# EAGLE design cc2650_rev1-1 (EAGLE 8.3.2)

## Sheet 1 of 2
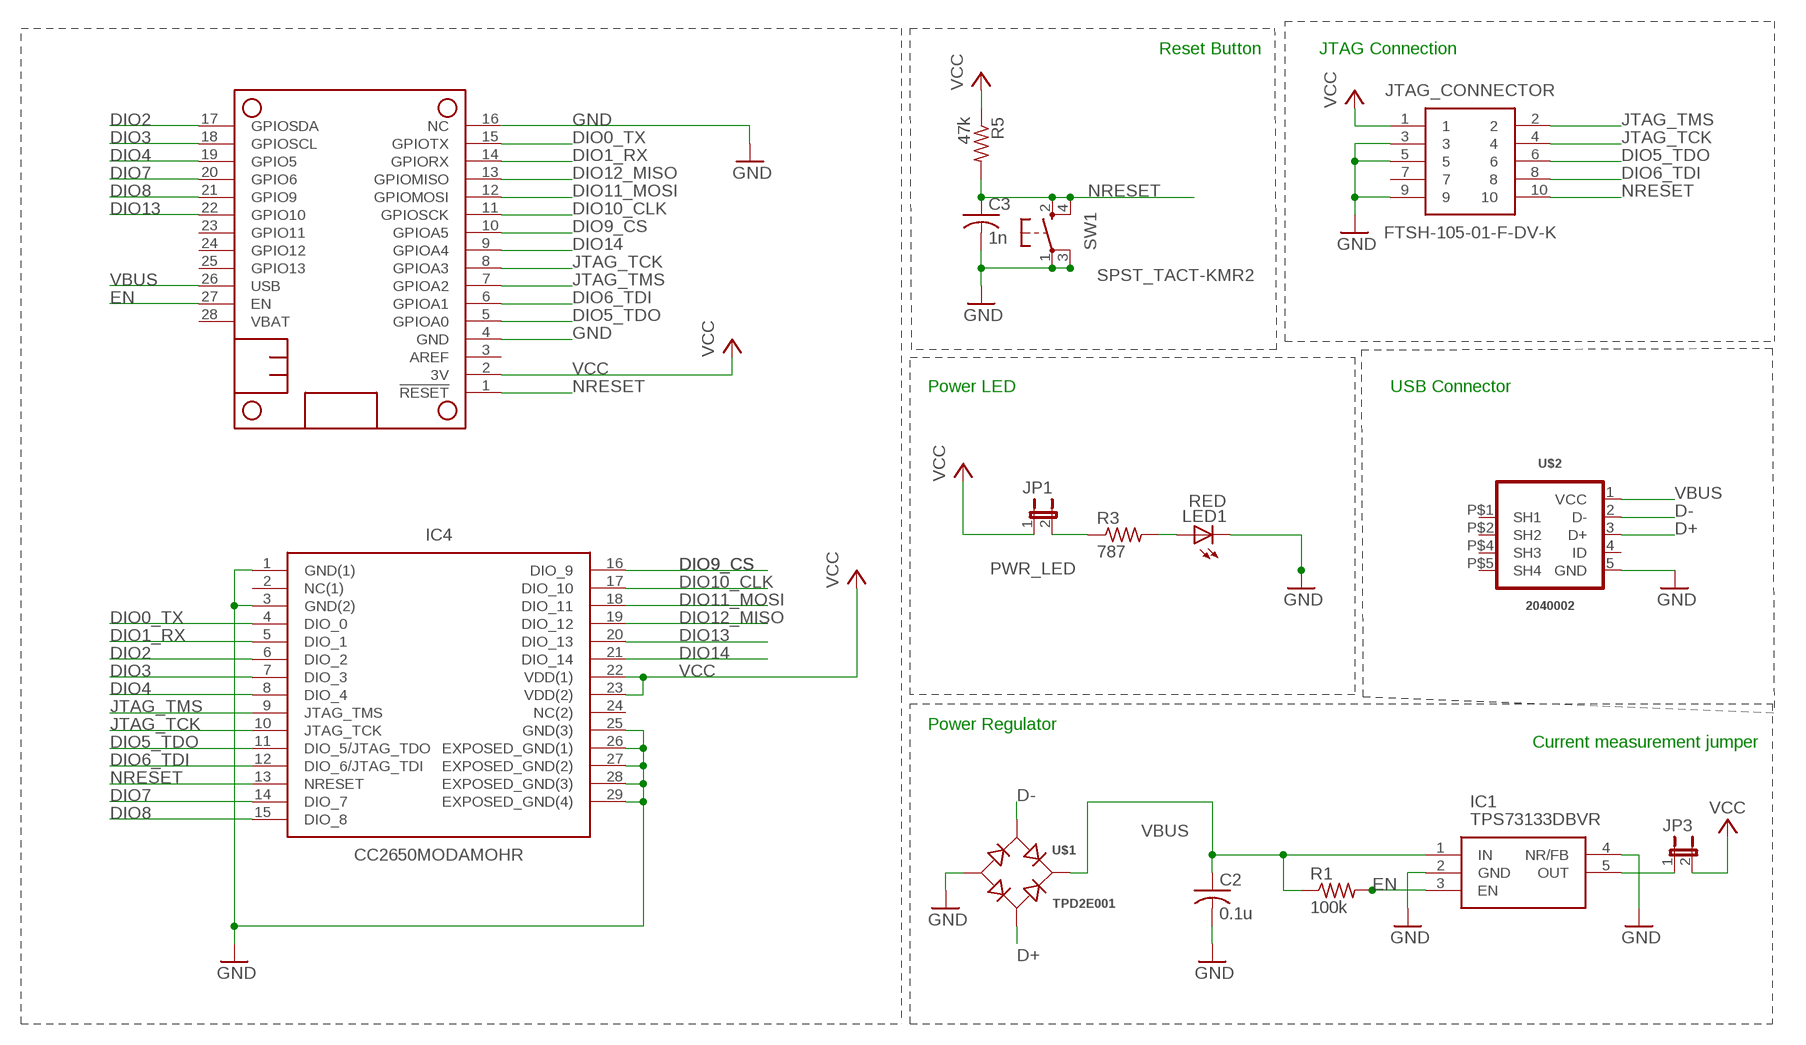
[diagram p0: schematic, sheet 1]

### Parts
C2  0.1u  C-USC1206  [C1206]
C3  1n  C-USC1206  [C1206]
IC1  TPS73133DBVR  [SOT95P280X145-5N]
IC4  CC2650MODAMOHR  [MOH0029A]
JP1  PWR_LED  JP1M  [JP1M]
JP3  PWR_LED  JP1M  [JP1M]
JTAG_CONNECTOR  FTSH-105-01-F-DV-K  [SAMTEC_FTSH-105-01-L-DV]
LED1  RED  LEDCHIPLED_1206  [CHIPLED_1206]
MS1  FEATHERWING_NODIM  [FEATHERWING_DIM]
R1  100k  R-US_R1206  [R1206]
R3  787  R-US_R1206  [R1206]
R5  47k  R-US_R1206  [R1206]
SW1  SPST_TACT-KMR2  [KMR2]
U$1  TPD2E001  [SOT-143]
U$2  2040002  [2040002]

### Nets
D+: U$1.3(AC2) U$2.3(D+)
D-: U$1.2(AC1) U$2.2(D-)
DIO0_TX: IC4.4(DIO_0) MS1.15(GPIOTX)
DIO1_RX: IC4.5(DIO_1) MS1.14(GPIORX)
DIO2: IC4.6(DIO_2) MS1.17(GPIOSDA)
DIO3: IC4.7(DIO_3) MS1.18(GPIOSCL)
DIO4: IC4.8(DIO_4) MS1.19(GPIO5)
DIO5_TDO: IC4.11(DIO_5/JTAG_TDO) JTAG_CONNECTOR.6 MS1.5(GPIOA0)
DIO6_TDI: IC4.12(DIO_6/JTAG_TDI) JTAG_CONNECTOR.8 MS1.6(GPIOA1)
DIO7: IC4.14(DIO_7) MS1.20(GPIO6)
DIO8: IC4.15(DIO_8) MS1.21(GPIO9)
DIO9_CS: IC4.16(DIO_9) MS1.10(GPIOA5)
DIO10_CLK: IC4.17(DIO_10) MS1.11(GPIOSCK)
DIO11_MOSI: IC4.18(DIO_11) MS1.12(GPIOMOSI)
DIO12_MISO: IC4.19(DIO_12) MS1.13(GPIOMISO)
DIO13: IC4.20(DIO_13) MS1.22(GPIO10) ; also sheet 2
DIO14: IC4.21(DIO_14) MS1.9(GPIOA4) ; also sheet 2
EN: IC1.3(EN) MS1.27(EN) R1.2
GND: C2.2 C3.2 IC1.2(GND) IC1.4(NR/FB) IC4.1(GND(1)) IC4.3(GND(2)) IC4.25(GND(3)) IC4.26(EXPOSED_GND(1)) IC4.27(EXPOSED_GND(2)) IC4.28(EXPOSED_GND(3)) IC4.29(EXPOSED_GND(4)) JTAG_CONNECTOR.3 JTAG_CONNECTOR.5 JTAG_CONNECTOR.9 LED1.C MS1.4(GND) MS1.16(NC) SW1.1(P) SW1.3(P1) U$1.1(-) U$2.5(GND) ; also sheet 2
JTAG_TCK: IC4.10(JTAG_TCK) JTAG_CONNECTOR.4 MS1.8(GPIOA3)
JTAG_TMS: IC4.9(JTAG_TMS) JTAG_CONNECTOR.2 MS1.7(GPIOA2)
NRESET: C3.1 IC4.13(NRESET) JTAG_CONNECTOR.10 MS1.1(!RESET) R5.2 SW1.2(S) SW1.4(S1)
PWR_LED: LED1.A R3.2
PWR_LED_JPR: JP1.2 R3.1
VBUS [Power]: C2.1 IC1.1(IN) MS1.26(USB) R1.1 U$1.4(+) U$2.1(VCC)
VCC: IC4.22(VDD(1)) IC4.23(VDD(2)) JP1.1 JP3.2 JTAG_CONNECTOR.1 MS1.2(3V) R5.1
VCC_JPR: IC1.5(OUT) JP3.1
Unconnected: IC4.2(NC(1)) IC4.24(NC(2)) JTAG_CONNECTOR.7 MS1.3(AREF) MS1.23(GPIO11) MS1.24(GPIO12) MS1.25(GPIO13) MS1.28(VBAT) U$2.4(ID) U$2.P$1(SH1) U$2.P$2(SH2) U$2.P$4(SH3) U$2.P$5(SH4)

### Notes on the sheet
- Reset Button | JTAG Connection
- Power LED | USB Connector
- Power Regulator
- Current measurement jumper

## Sheet 2 of 2
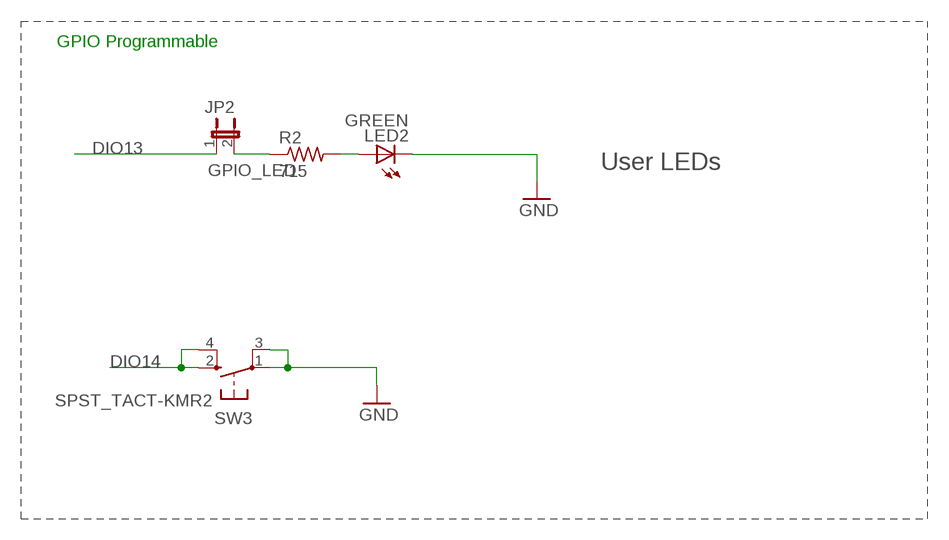
[diagram p1: schematic, sheet 2]

### Parts
JP2  GPIO_LED  JP1M  [JP1M]
LED2  GREEN  LEDCHIPLED_1206  [CHIPLED_1206]
R2  715  R-US_R1206  [R1206]
SW3  SPST_TACT-KMR2  [KMR2]

### Nets
DIO13: JP2.1 ; also sheet 1
DIO14: SW3.2(S) SW3.4(S1) ; also sheet 1
GND: LED2.C SW3.1(P) SW3.3(P1) ; also sheet 1
GPIO_LED: LED2.A R2.2
GPIO_LED_JPR: JP2.2 R2.1

### Notes on the sheet
- GPIO Programmable
- User LEDs

## Library data of the parts
C2 C3 = adafruit:C-US: CAPACITOR, American symbol; MF: VISHAY/VITRAMON; MPN: VJ1206Y102KXBAC; OC_NEWARK: 48C2970
IC1 = TPS73133DBVR:TPS73133DBVR: Texas Instruments TPS73133DBVR, LDO Voltage Regulator, 0.15A, 3.3 V 0.5%, 1.7 5.5 Vin, 5-Pin SOT-23 Source: Datasheet <http://www.ti.com/lit/gpn/tps731>; DESCRIPTION: Texas Instruments TPS73133DBVR, LDO Voltage Regulator, 0.15A, 3.3 V 0.5%, 1.7 5.5 Vin, 5-Pin SOT-23; HEIGHT: 1.45mm; MANUFACTURER_NAME: Texas Instruments; MANUFACTURER_PART_NUMBER: TPS73133DBVR; MPN: TPS73133DBVR; OC_NEWARK: 86W6350; RS_PART_NUMBER: 6613970; SUPPLIER_NAME: RS
IC4 = CC2650MODAMOHR(2):CC2650MODAMOHR: SimpleLink Bluetooth low energy Wireless MCU Module <https://componentsearchengine.com/Images/9/CC2650MODAMOHR.jpg> Source: Datasheet <http://www.ti.com/lit/gpn/cc2650moda>; DESCRIPTION: SimpleLink Bluetooth low energy Wireless MCU Module; HEIGHT: mm; MANUFACTURER_NAME: Texas Instruments; MANUFACTURER_PART_NUMBER: CC2650MODAMOHR; MPN: CC2650MODAMOHR; OC_NEWARK: 02AC9626; SUPPLIER_NAME: RS
JP1-JP3 = jumper:JP1M; MPN: 2211S-02G; OC_NEWARK: 08N6744
JTAG_CONNECTOR = FTSH-105-01-F-DV-K:FTSH-105-01-F-DV-K: .050 x .050 CL DOUBLE VERTICAL SMT TERMINAL STRIP <https://componentsearchengine.com/Images/9/FTSH-105-01-F-DV-K.jpg> Source: Datasheet <http://suddendocs.samtec.com/prints/ftsh-1xx-xx-xxx-dv-xxx-xxx-mkt.pdf>; DESCRIPTION: .050 x .050 CL DOUBLE VERTICAL SMT TERMINAL STRIP; HEIGHT: mm; MANUFACTURER_NAME: SAMTEC; MANUFACTURER_PART_NUMBER: FTSH-105-01-F-DV-K; MPN: FTSH-105-01-F-DV-K; OC_NEWARK: 45P5160; SUPPLIER_NAME: RS
LED1 LED2 = adafruit:LED: LED OSRAM: - CHIPLED LG R971, LG N971, LY N971, LG Q971, LY Q971, LO R971, LY R971 LH N974, LH R974 LS Q976, LO Q976, LY Q976 LO Q996 - Hyper CHIPLED LW Q18S LB Q993, LB Q99A, LB R99A - SideLED LS A670, LO A670, LY A670, LG A670, LP A670 LB A673, LV A673, LT A673, LW A673 LH A674 LY A675 LS A676, LA A676, LO A676, LY A676, LW A676 LS A679, LY A679, LG A679 - Hyper Micro SIDELED® LS Y876, LA Y876, LO Y876, LY Y876 LT Y87S - SmartLED LW L88C, LW L88S LB L89C, LB L89S, LG L890 LS L89K, LO L89K, LY L89K LS L896, LA L896, LO L896, LY L896 - TOPLED LS T670, LO T670, LY T670, LG T670, LP T670 LSG T670, LSP T670, LSY T670, LOP T670, LYG T670 LG T671, LOG T671, LSG T671 LB T673, LV T673, LT T673, LW T673 LH T674 LS T676, LA T676, LO T676, LY T676, LB T676, LH T676, LSB T676, LW T676 LB T67C, LV T67C, LT T67C, LS T67K, LO T67K, LY T67K, LW E67C LS E67B, LA E67B, LO E67B, LY E67B, LB E67C, LV E67C, LT E67C LW T67C LS T679, LY T679, LG T679 LS T770, LO T770, LY T770, LG T770, LP T770 LB T773, LV T773, LT T773, LW T773 LH T774 LS E675, LA E675, LY E675, LS T675 LS T776, LA T776, LO T776, LY T776, LB T776 LHGB T686 LT T68C, LB T68C - Hyper Mini TOPLED® LB M676 - Mini TOPLED Santana® LG M470 LS M47K, LO M47K, LY M47K Source: http://www.osram.convergy.de/; MPN: HSMC-C150; OC_NEWARK: 05M0343
MS1 = wing_modified:FEATHERWING
R1-R3 = adafruit:R-US_: RESISTOR, American symbol; MPN: CR1206-FX-4700ELF; OC_NEWARK: 06X5194
R5 = adafruit:R-US_: RESISTOR, American symbol; MF: VISHAY/DALE; MPN: CRCW120647K0FKTA; OC_NEWARK: 32C8848
SW1 SW3 = adafruit:SPST_TACT: SMT 6mm switch, EVQQ2 series http://www.ladyada.net/library/eagle; MPN: KMR241G LFS; OC_NEWARK: 58M7854
U$1 = AMP_Ruler-LT1370:TPD2E001
U$2 = AMP_Ruler-LT1370:2040002

## Net classes
0 Default: width 0.203 mm, drill 0.305 mm, clearance 0.152 mm
1 Ground: width 0.203 mm, drill 0.305 mm, clearance 0.152 mm to class 0, clearance 0.152 mm
2 Power: width 0.203 mm, drill 0.305 mm, clearance 0.152 mm to class 0, clearance 0.152 mm to class 1, clearance 0.152 mm

## Board
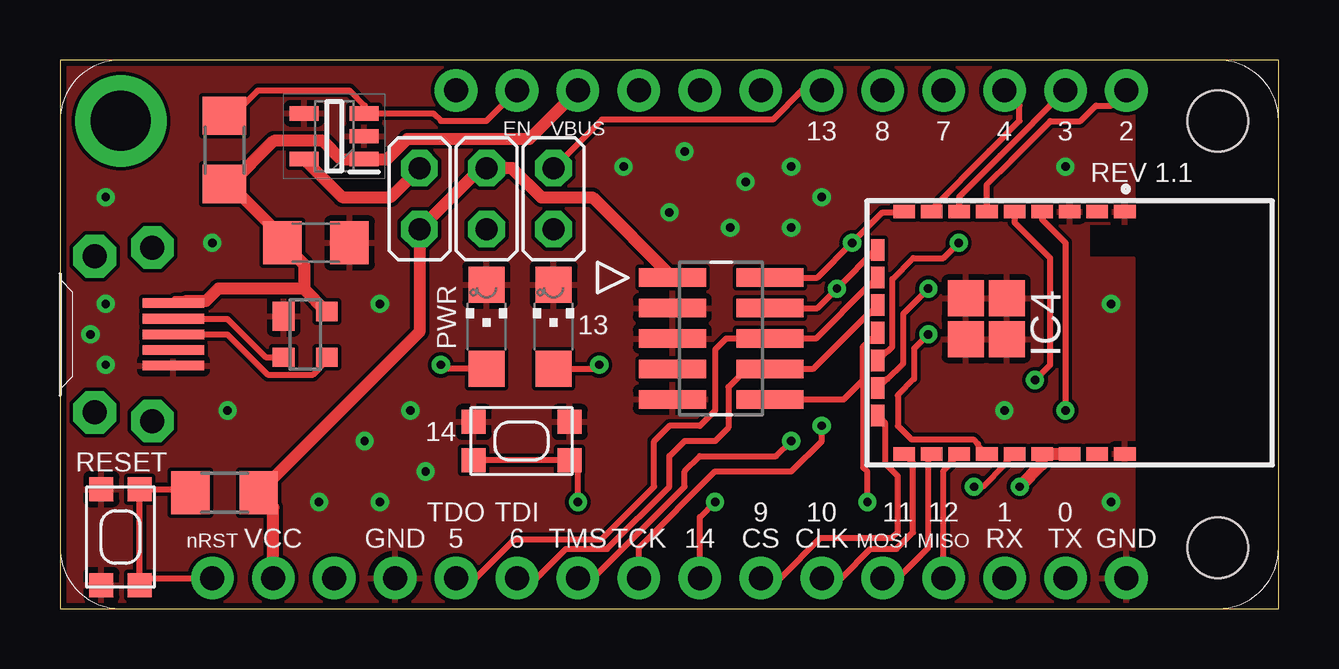
[diagram p2: board, top side]
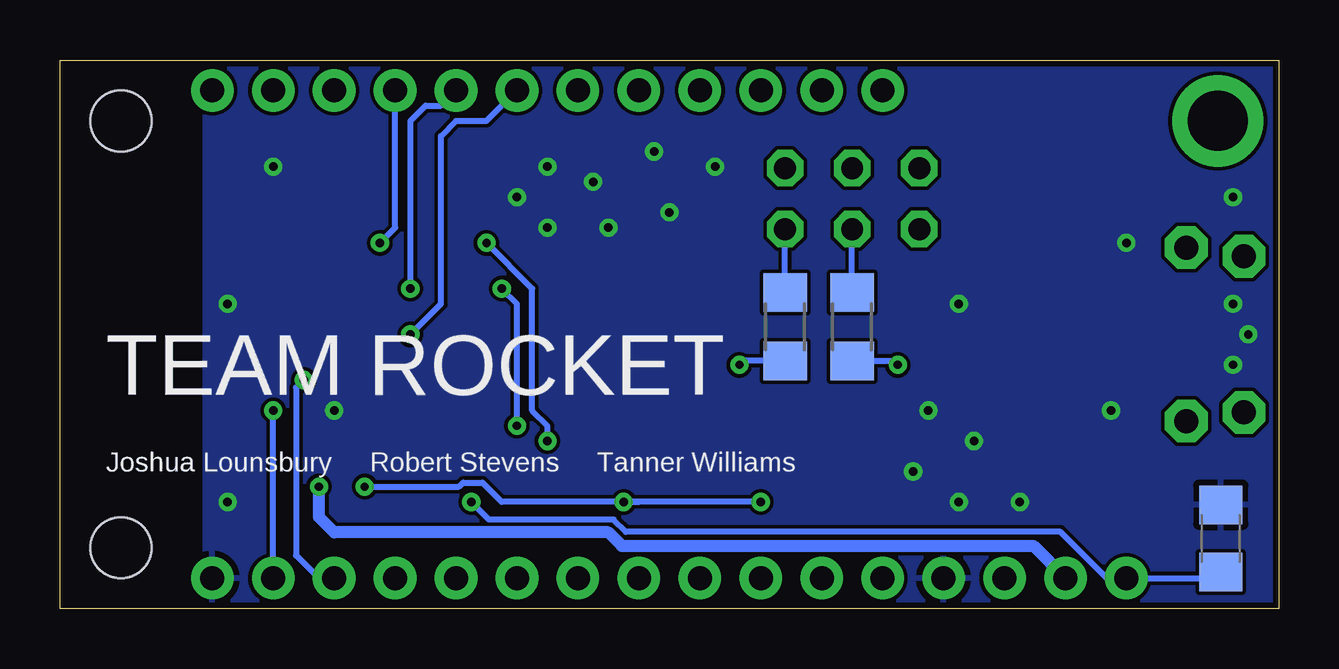
[diagram p3: board, bottom side, seen from below]

Size 50.8 x 22.86 mm. Coordinates in mm from the lower left corner, seen from the top.
Outline: 0,0 50.8,0 50.8,22.86 0,22.86 0,0
Copper layers (1*16): Top 0.035mm / dielectric 1.5mm / Bottom 0.035mm
Design rules "Adafruit Design Rules *": minimum track width 6mil, minimum drill 3mil, track to track 6mil, track to pad 8mil, pad to pad 6mil, via to via 12mil, smd to smd 8mil, copper to edge 10mil, drill to drill 3mil, minimum pad ring 10mil, minimum via ring 8mil, stop-mask expansion 2mil, vias tented up to drill 14mil, thermal gap 10mil

### Footprints (pad centres in the part's own frame; a part is rotated, then mirrored left to right if it is on the bottom)
C1206 = smd 1.6 x 1.8: 1 -1.4,0; 2 1.4,0
SOT95P280X145-5N = smd 1.2 x 0.6: 1 -1.25,0.95; 2 -1.25,0; 3 -1.25,-0.95; 4 1.25,-0.95; 5 1.25,0.95
MOH0029A = smd 0.55 x 0.9: 1 -5.05,-6.15; 2 -5.05,-7.3; 3 -5.05,-8.45; 4 -5.05,-9.6; 5 -5.05,-10.75; 6 -5.05,-11.9; 7 -5.05,-13.05; 8 -5.05,-14.2; 9 -5.05,-15.35; 17 5.05,-15.35; 18 5.05,-14.2; 19 5.05,-13.05; 20 5.05,-11.9; 21 5.05,-10.75; 22 5.05,-9.6; 23 5.05,-8.45; 24 5.05,-7.3; 25 5.05,-6.15 | smd 0.9 x 0.55: 10 -3.45,-16.45; 11 -2.3,-16.45; 12 -1.15,-16.45; 13 0,-16.45; 14 1.15,-16.45; 15 2.3,-16.45; 16 3.45,-16.45 | smd 1.5 x 1.5: 26 -1.435,-11.075; 27 -1.435,-12.775; 28 0.265,-12.775; 29 0.265,-11.075
JP1M = drill 0.914 pad 1.524 octagon: 1 0,-1.27; 2 0,1.27
SAMTEC_FTSH-105-01-L-DV = smd 0.762 x 2.794: 1 -2.54,-2.032; 2 -2.54,2.032; 3 -1.27,-2.032; 4 -1.27,2.032; 5 0,-2.032; 6 0,2.032; 7 1.27,-2.032; 8 1.27,2.032; 9 2.54,-2.032; 10 2.54,2.032
CHIPLED_1206 = smd 1.5 x 1.5: A 0,-1.75; C 0,1.75
FEATHERWING_DIM = drill 1 pad 1.778: 1 6.35,1.27; 2 8.89,1.27; 3 11.43,1.27; 4 13.97,1.27; 5 16.51,1.27; 6 19.05,1.27; 7 21.59,1.27; 8 24.13,1.27; 9 26.67,1.27; 10 29.21,1.27; 11 31.75,1.27; 12 34.29,1.27; 13 36.83,1.27; 14 39.37,1.27; 15 41.91,1.27; 16 44.45,1.27; 17 44.45,21.59; 18 41.91,21.59; 19 39.37,21.59; 20 36.83,21.59; 21 34.29,21.59; 22 31.75,21.59; 23 29.21,21.59; 24 26.67,21.59; 25 24.13,21.59; 26 21.59,21.59; 27 19.05,21.59; 28 16.51,21.59 | drill 2.5 pad 3.81: P$1 2.54,20.32 | hole 2.54: 48.26,20.32; 48.26,2.54
R1206 = smd 1.6 x 1.803: 1 -1.422,0; 2 1.422,0
KMR2 = smd 1 x 1: 1 2,0.8; 2 2,-0.8; 3 -2,0.8; 4 -2,-0.8
SOT-143 = smd 1.2 x 0.9: 1 -0.75,-0.9 | smd 0.8 x 0.9: 2 0.95,-0.9; 3 0.95,0.9; 4 -0.95,0.9
2040002 = smd 0.4 x 2.55: 1 -1.3,4.725; 2 -0.65,4.725; 3 0,4.725; 4 0.65,4.725; 5 1.3,4.725 | drill 1 pad 1.778 octagon: P$1 3.255,1.45; P$2 -3.255,1.45; P$4 -3.615,3.85; P$5 3.615,3.85

### Placement (x,y rotation side)
C2  10.67,15.24 0 top
C3  2.41,2.92 90 bottom
IC1  11.43,19.68 180 top
IC4  50.53,11.49 270 top
JP1  17.78,17.08 180 top
JP2  20.57,17.08 180 top
JP3  14.99,17.08 180 top
JTAG_CONNECTOR  27.56,11.26 270 top
LED1  17.78,11.75 0 top
LED2  20.57,11.75 0 top
MS1  0,0 0 top
R1  6.86,19.11 90 top
R2  20.57,11.75 270 bottom
R3  17.78,11.75 270 bottom
R5  6.86,4.83 180 top
SW1  2.52,2.98 90 top
SW3  19.24,6.99 0 top
U$1  10.22,11.43 270 top
U$2  0,11.43 270 top

### Tracks (layer width: path | path; a pad name or v marks a point on that pad's centre or on a via)
D+
  Top 0.254: U$2.3 6.97,11.43 8.65,9.75 10.54,9.75 11.12,10.33 U$1.3
D-
  Top 0.254: U$2.2 4.74,12.06 6.99,12.06 8.57,10.48 U$1.2
DIO0_TX  (via drill 0.35)
  Top 0.254: IC4.4 40.93,16.22 41.91,15.24 v41.91,8.26
  Bottom 0.254: MS1.15 v41.91,8.26
DIO1_RX  (via drill 0.35)
  Top 0.254: IC4.5 39.78,16.1 41.27,14.61 41.27,10.16 v40.64,9.53
  Bottom 0.254: MS1.14 40.01,1.27 40.96,2.22 40.96,9.21 v40.64,9.53
DIO2
  Top 0.254: IC4.6 38.63,17.66 39.65,18.67 39.65,18.68 41.28,20.31 42.54,20.31 43.18,20.95 43.81,20.95 MS1.17
DIO3
  Top 0.254: IC4.7 37.48,17.15 39.19,18.86 39.19,18.87 MS1.18
DIO4
  Top 0.254: IC4.8 36.33,16.65 38.73,19.05 38.73,19.06 40,20.33 40,20.96 MS1.19
DIO5_TDO
  Top 0.254: MS1.5 17.33,1.27 18.95,2.9 22.58,2.9 24.77,5.08 24.77,6.99 25.4,7.62 26.67,7.62 27.05,8 27.06,8 27.3,8.25 27.3,10.79 27.77,11.26 JTAG_CONNECTOR.6 31.5,11.26 33.67,13.42 33.71,13.42 IC4.11
DIO6_TDI
  Top 0.254: 33.97,12.53 IC4.12 33.71,12.27 33.67,12.27 31.38,9.98 JTAG_CONNECTOR.8 28.62,9.98 27.86,9.23 27.86,7.54 27.3,6.99 26.04,6.99 25.4,6.35 25.4,5.08 22.81,2.49 21.09,2.49 19.87,1.27 MS1.6
DIO7  (via drill 0.35)
  Top 0.254: IC4.14 34.45,10.71 34.5,10.71 34.69,10.91 34.69,13.73 35.56,14.61 36.83,14.61 v37.47,15.24
  Bottom 0.254: v37.47,15.24 36.83,15.88 MS1.20
DIO8  (via drill 0.35)
  Top 0.254: v36.2,13.34 35.15,12.29 35.15,10.21 34.5,9.56 34.45,9.56 IC4.15
  Bottom 0.254: v36.2,13.34 36.2,14.61 | 36.2,14.61 36.2,14.87 | MS1.21 34.92,20.95 35.56,20.95 36.2,20.32 36.2,14.61
DIO9_CS
  Top 0.254: MS1.10 30.03,1.27 31.7,2.95 34.69,2.95 34.92,3.18 34.92,5.52 34.4,6.03 34.4,7.72 IC4.16
DIO10_CLK
  Top 0.254: MS1.11 32.57,1.27 33.78,2.49 34.87,2.49 35.56,3.17 35.56,6.03 35.55,6.03 35.55,6.07 IC4.17
DIO11_MOSI
  Top 0.254: MS1.12 34.92,1.27 36.2,2.54 36.2,6.3 IC4.18
DIO12_MISO
  Top 0.254: IC4.19 37.11,6.07 37.11,6.03 36.83,5.75 MS1.13
DIO13  (via drill 0.35)
  Top 0.254: IC4.20 38.26,6.81 38.26,6.86 38.07,7.05 35.5,7.05 34.92,7.62 34.92,8.89 35.6,9.57 35.6,10.84 v36.2,11.43 | MS1.22 30.93,21.59 29.71,20.37 22.59,20.37 JP2.1
  Bottom 0.254: MS1.22 33.02,20.32 34.29,20.32 34.92,19.68 34.92,12.7 v36.2,11.43
DIO14  (via drill 0.35)
  Top 0.254: IC4.21 39.41,6.07 39.41,6.03 38.46,5.08 v38.1,5.08 | v27.3,4.45 26.67,3.81 MS1.9 | v21.59,4.45 21.59,5.83 SW3.2 SW3.4
  Bottom 0.254: v38.1,5.08 34.17,5.08 33.99,5.25 33.2,5.25 32.38,4.45 v27.3,4.45 | v27.3,4.45 26.67,4.45 | v21.59,4.45 v27.3,4.45
EN
  Top 0.254: R1.2 7.2,20.54 8.26,21.59 12.06,21.59 12.7,20.95 12.7,20.66 IC1.3 15.56,20.64 15.88,20.32 17.78,20.32 MS1.27
GND  (via drill 0.35)
  other vias: 6.99,8.26 12.7,6.99 1.91,17.14 6.35,15.24 1.91,12.7 1.27,11.43 1.91,10.16 10.79,4.45 13.34,4.45 15.24,5.71 14.61,8.26 13.34,12.7 23.5,18.41 26.04,19.05 25.4,16.51 27.94,15.88 28.57,17.78 30.48,18.41 31.75,17.14 30.48,15.88 41.91,18.41 43.81,12.7 39.37,8.26 43.81,4.45
  pour Bottom: 0,22.86 44.77,22.86 44.77,0 0,0
  pour Top: 0,22.92 0,0 44.77,0 44.77,14.61 42.86,14.61 42.86,16.07 44.77,16.07 44.77,22.92
GPIO_LED  (via drill 0.35)
  Top 0.254: 20.79,10 LED2.A 22.32,10 v22.48,10.16
  Bottom 0.254: 21.12,10.32 R2.2 22.31,10.32 v22.48,10.16
GPIO_LED_JPR
  Bottom 0.254: R2.1 JP2.2
JTAG_TCK  (via drill 0.35)
  Top 0.254: 34.04,14.99 IC4.10 | 34.04,14.99 33.96,15.06 | MS1.8 24.13,2.54 27.3,5.71 30.48,5.71 31.75,6.99 v31.75,7.62 | JTAG_CONNECTOR.4 31.57,12.53 v32.38,13.34 34.04,14.99
  Bottom 0.254: v31.75,7.62 31.75,12.7 v32.38,13.34
JTAG_TMS  (via drill 0.35)
  Top 0.254: MS1.7 22.23,1.27 26.04,5.08 26.04,5.71 26.67,6.35 29.84,6.35 v30.48,6.99 | JTAG_CONNECTOR.2 31.57,13.79 v33.02,15.24 34.29,16.51 35.15,16.51 IC4.9
  Bottom 0.254: v33.02,15.24 31.11,13.34 31.11,8.26 30.48,7.62 v30.48,6.99
NRESET  (via drill 0.35)
  Top 0.254: MS1.1 3.61,1.27 SW1.4 SW1.2 5.28,4.98 R5.2 | IC4.13 33.71,11.12 33.67,11.12 33.48,10.93 33.48,9.53 | 33.48,9.53 33.48,5.89 33.66,5.71 v33.66,4.45 | JTAG_CONNECTOR.10 32.67,8.71 33.48,9.53
  Bottom 0.254: C3.1 2.66,1.27 MS1.1 7.17,1.27 9.1,3.2 27.21,3.2 27.72,3.71 32.92,3.71 v33.66,4.45
PWR_LED  (via drill 0.35)
  Top 0.254: 17.78,10.03 LED1.A 16.04,10 v15.88,10.16
  Bottom 0.254: 17.49,10.32 R3.2 16.04,10.32 v15.88,10.16
PWR_LED_JPR
  Bottom 0.254: R3.1 JP1.2
VBUS
  Top 0.406: U$2.1 4.82,12.83 5.27,12.83
  Top 0.508: R1.1 6.99,17.56 7.09,17.67 | 7.09,17.67 8.91,19.49 10.97,19.49 11.73,18.73 IC1.1 13.64,18.73 14.48,19.57 19.57,19.57 MS1.26 | 7.09,17.67 9.27,15.5 C2.1 10.17,14.34 10.17,13.34 | 10.17,13.34 6.6,13.34 6.09,12.83 5.27,12.83 | U$1.4 10.17,13.34
VCC  (via drill 0.35)
  Top 0.508: IC4.23 IC4.22 40.93,6.01 v40.01,5.08 | MS1.2 8.89,4.22 R5.1 14.99,11.53 JP3.2 17.53,18.35 JP1.1 18.85,18.35 20.07,17.13 22.19,17.13 JTAG_CONNECTOR.1
  Bottom 0.508: MS1.2 10.24,2.62 27.38,2.62 27.94,3.17 39.37,3.17 40.01,3.81 v40.01,5.08
VCC_JPR
  Top 0.508: IC1.5 11.77,17.14 13.78,17.14 JP3.1

### Text on the board
tNames: EN | VBUS | 13 | 8 | 7 | 4 | 3 | 2 | REV 1.1 | PWR | 13 | 14 | RESET | TDO | TDI | 9 | 10 | 11 | 12 | 1 | 0 | nRST | VCC | GND | 5 | 6 | TMS | TCK | 14 | CS | CLK | MOSI | MISO | RX | TX | GND
bNames: TEAM ROCKET | Joshua Lounsbury Robert Stevens Tanner Williams